# EAGLE design mon-one-exp-1wire (EAGLE 9.6.2)
Assembly variants: proto-click
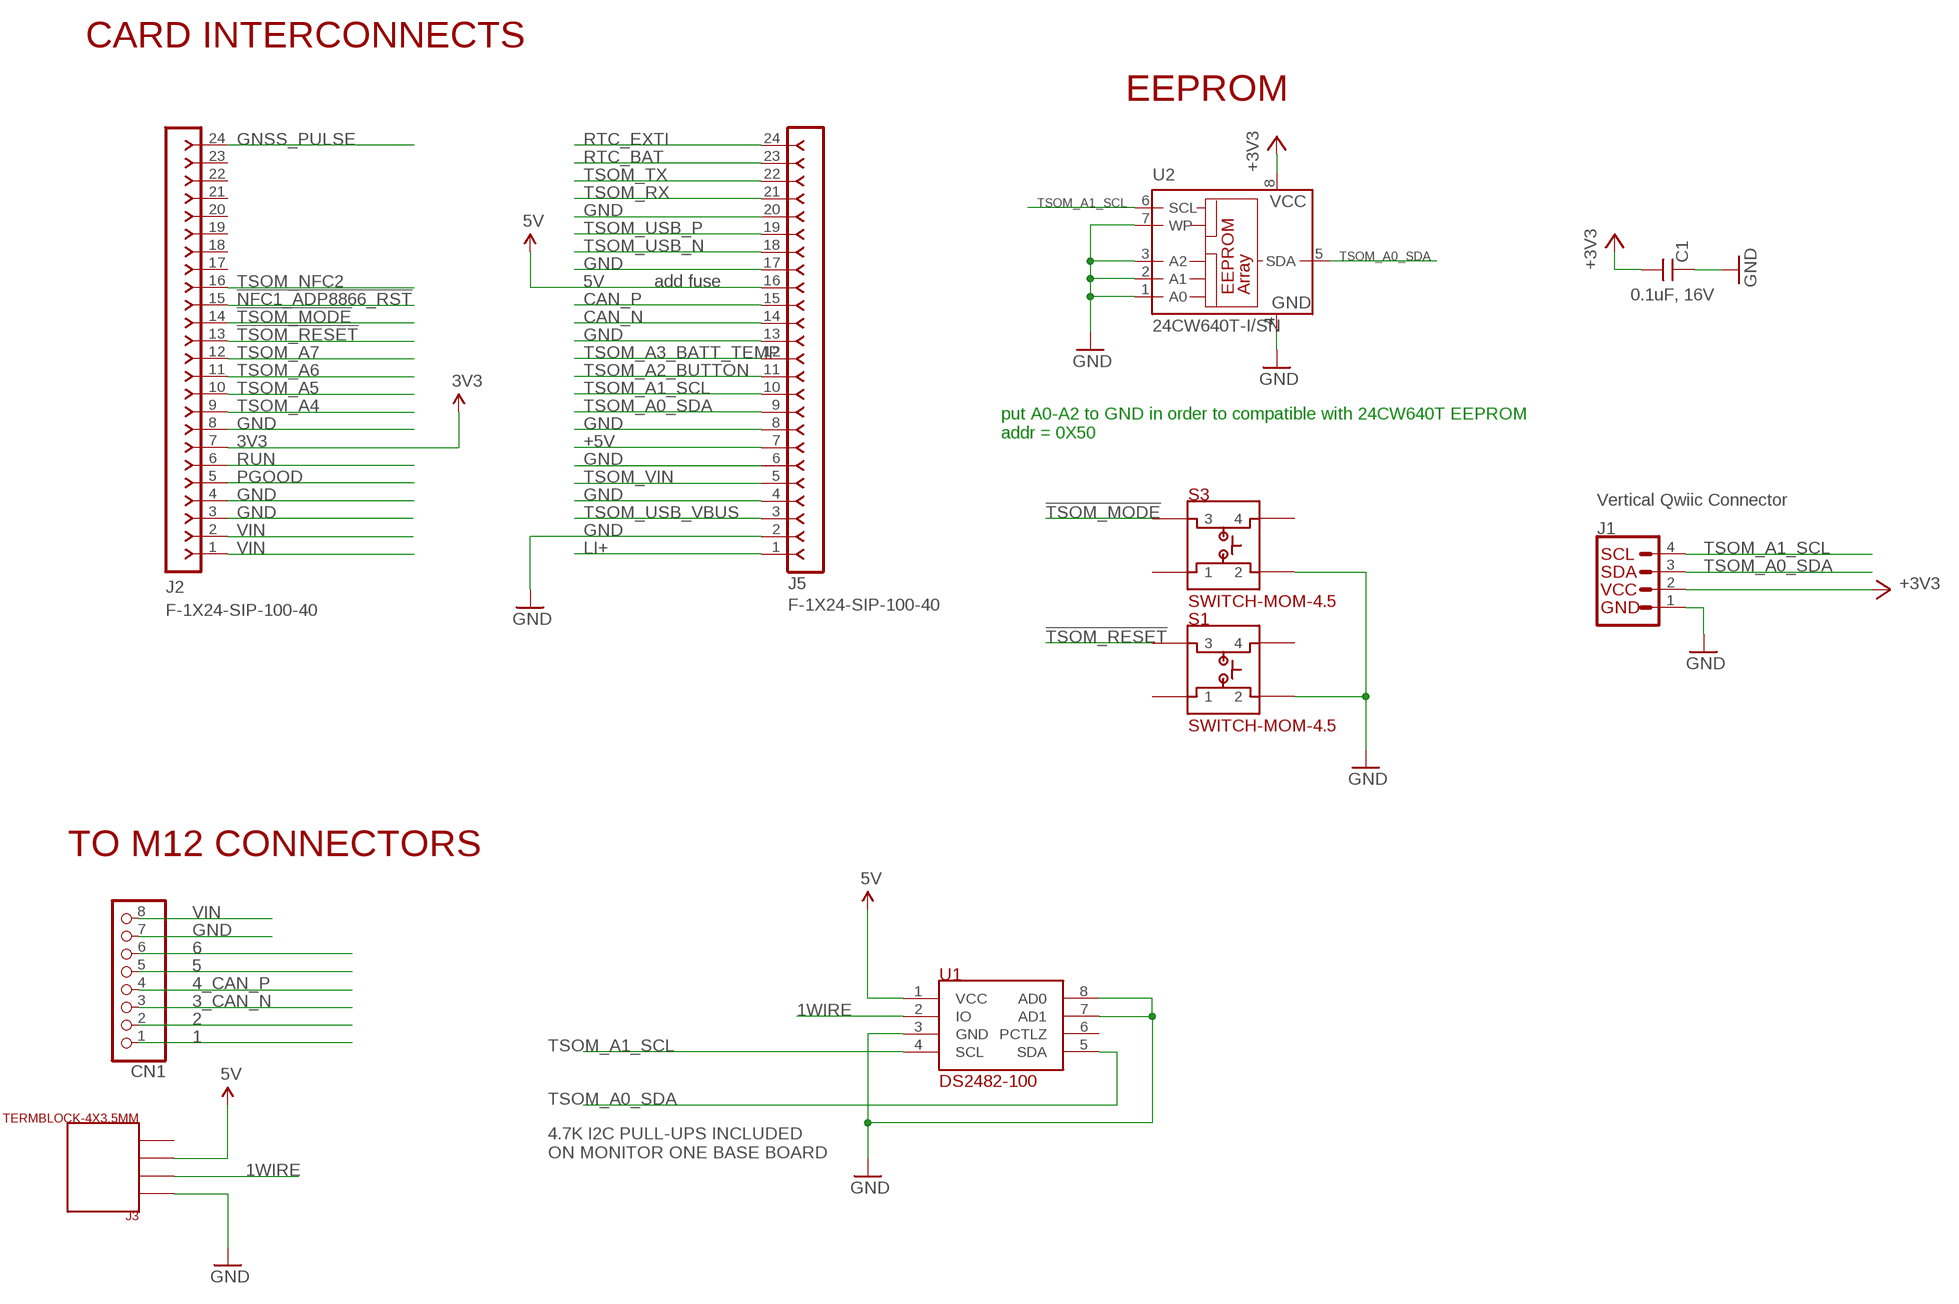
[diagram p0: schematic, sheet 1]

## Parts
C1  0.1uF, 16V  CAP_0.1UF_16V_0603  [C0603_P]  (not fitted in variant proto-click)
CN1  JST_8PIN  [JSTPH8]
J1  Vertical Qwiic Connector  QWIIC_CONNECTOR  [JST04_1MM_VERT]
J2  F-1X24-SIP-100-40  [SIP-100-24-40]
J3  TERMBLOCK-4X3.5MM  [TERMBLOCK-4X3.5MM]
J5  F-1X24-SIP-100-40  [SIP-100-24-40]
S1  SWITCH-MOM-4.5  [SWITCH-MOM-4.5]
S3  SWITCH-MOM-4.5  [SWITCH-MOM-4.5]
U1  DS2482-100  [8-SOIC-MAXIM]
U2  24CW640T-I/SN  24AA01SN  [SO-08]  (not fitted in variant proto-click)

## Nets
1: CN1.1
1WIRE: J3.2 U1.2(IO)
2: CN1.2
3_CAN_N: CN1.3
3V3: C1.1 J1.2 J2.7 U2.8(VCC) ; supply symbol labelled +3V3
4_CAN_P: CN1.4
5: CN1.5
5V: J3.3 J5.16 U1.1(VCC)
6: CN1.6
!NFC1_ADP8866_RST: J2.15
!TSOM_MODE: J2.14 S3.3
!TSOM_RESET: J2.13 S1.3
+5V: J5.7
CAN_N: J5.14
CAN_P: J5.15
GND: C1.2 CN1.7 J1.1 J2.3 J2.4 J2.8 J3.1 J5.2 J5.4 J5.6 J5.8 J5.13 J5.17 J5.20 S1.2 S3.2 U1.3(GND) U1.7(AD1) U1.8(AD0) U2.1(A0) U2.2(A1) U2.3(A2) U2.4(GND) U2.7(WP)
GNSS_PULSE: J2.24
LI+: J5.1
PGOOD: J2.5
RTC_BAT: J5.23
RTC_EXTI: J5.24
RUN: J2.6
TSOM_A0_SDA: J1.3 J5.9 U1.5(SDA) U2.5(SDA)
TSOM_A1_SCL: J1.4 J5.10 U1.4(SCL) U2.6(SCL)
TSOM_A2_BUTTON: J5.11
TSOM_A3_BATT_TEMP: J5.12
TSOM_A4: J2.9
TSOM_A5: J2.10
TSOM_A6: J2.11
TSOM_A7: J2.12
TSOM_NFC2: J2.16
TSOM_RX: J5.21
TSOM_TX: J5.22
TSOM_USB_N: J5.18
TSOM_USB_P: J5.19
TSOM_USB_VBUS: J5.3
TSOM_VIN: J5.5
VIN: CN1.8 J2.1 J2.2
Unconnected: J2.17 J2.18 J2.19 J2.20 J2.21 J2.22 J2.23 J3.4 S1.1 S1.4 S3.1 S3.4 U1.6(PCTLZ)

## Notes on the sheet
- CARD INTERCONNECTS
- EEPROM
- add fuse
- put A0-A2 to GND in order to compatible with 24CW640T EEPROM
  addr = 0X50
- TO M12 CONNECTORS
- 4.7K I2C PULL-UPS INCLUDED
  ON MONITOR ONE BASE BOARD

## Library data of the parts
C1 = particle-studios:CAP_: Particle Capacitors; DESP: CAP CER 0.1UF 16V X7R 0603; MFG: FENGHUA; MPN: 0603B104K160NT; PPN: PT-200082
CN1 = microbuilder:JST_8PIN: JST 8-Pin Right-Angle Connector
J1 = SparkFun-Connectors:QWIIC_CONNECTOR: SparkFun I2C Standard Qwiic Connector An SMD 1mm pitch JST connector makes it easy and quick (get it? Qwiic?) to connect I2C devices to each other. The Qwiic system <http://www.sparkfun.com/qwiic> enables fast and solderless connection between popular platforms and various sensors and actuators. We carry 200mm <https://www.sparkfun.com/products/14204>, 100mm <https://www.sparkfun.com/products/14205>, 50mm <https://www.sparkfun.com/products/14206>, and breadboard friendly <https://www.sparkfun.com/products/14207> Qwiic cables. We also offer 10 pcs strips <https://www.sparkfun.com/products/14323> the SMD connectors.; PROD_ID: CONN-14483
J2 J5 = con-headers-jp:F-1X24-: FEMALE HEADER
J3 = rickk2:TERMBLOCK-4X3.5MM: TERM BLK 4POS SIDE ENT 3.5MM PCB On Shore Technology Inc. OSTTE040161 $1.01 4 Position Wire to Board Terminal Block Horizontal with Board 0.138" (3.50mm) Through Hole https://www.digikey.com/product-detail/en/on-shore-technology-inc/OSTTE040161/ED2637-ND/614586
S1 S3 = rickk2:SWITCH-MOM-4.5: Manufacturer: E-Switch Manufacturer Part Number: TL3305AF160QG Description: SWITCH TACTILE SPST-NO 50MA 12V Detailed Description: Tactile Switch SPST-NO Top Actuated Surface Mount $0.20 https://www.digikey.com/product-detail/en/e-switch/TL3305AF160QG/EG5350CT-ND/5816195
U1 = rickk2:DS2482-100: IC BRIDGE I2C TO 1-WIRE 8-SOIC $1.54 1-Wire® Bridge, 1-Wire® to I²C I²C Interface 8-SOIC https://www.digikey.com/product-detail/en/maxim-integrated/DS2482S-100-/DS2482S-100--ND/1197435
U2 = microchip:24*: Serial EEPROM I2C; MF: MICROCHIP; MPN: 24AA01/SN; OC_FARNELL: 1331268; OC_NEWARK: 89C9792

## Net classes
1 USB: width 0.483 mm, clearance 0.152 mm
3 CAN: width 0.483 mm, clearance 0.152 mm

## Board
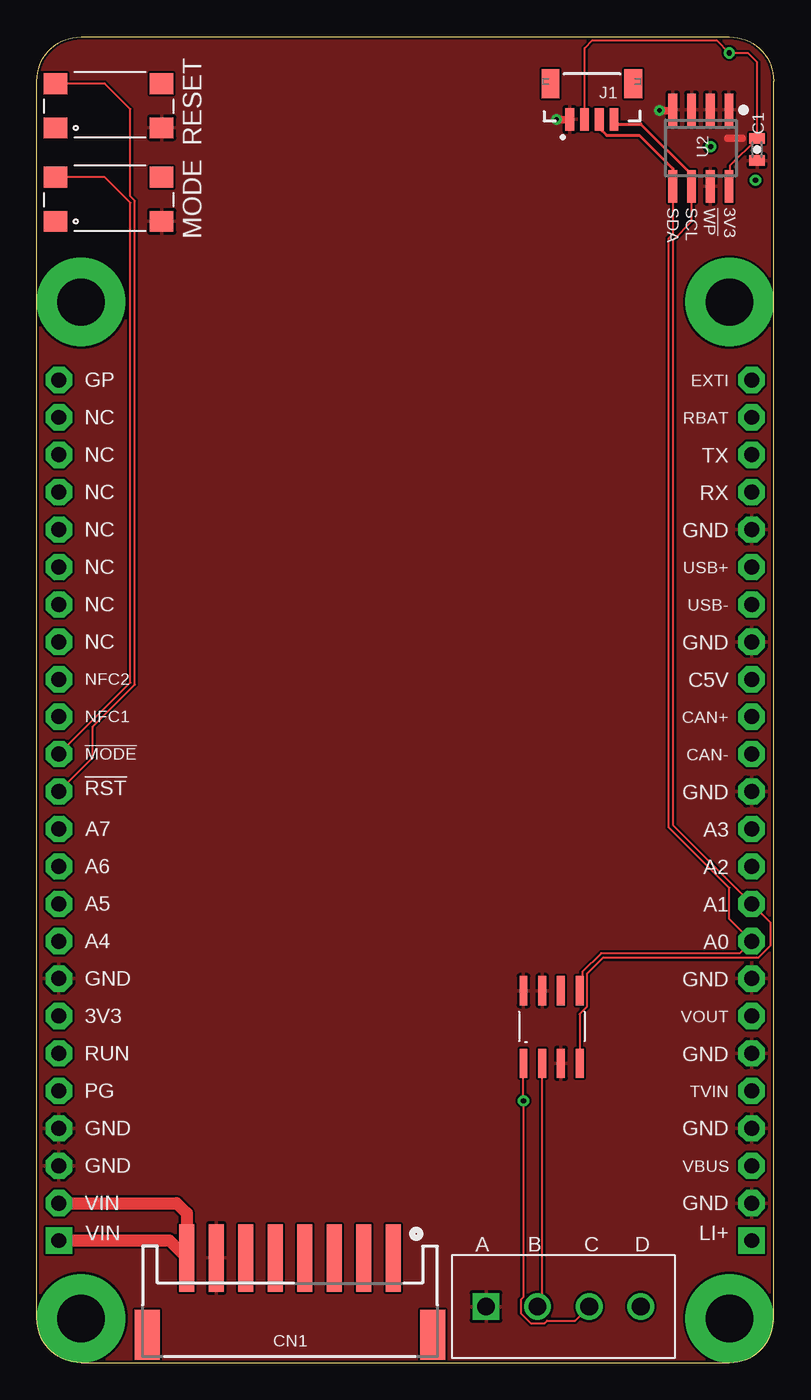
[diagram p1: board, top side]
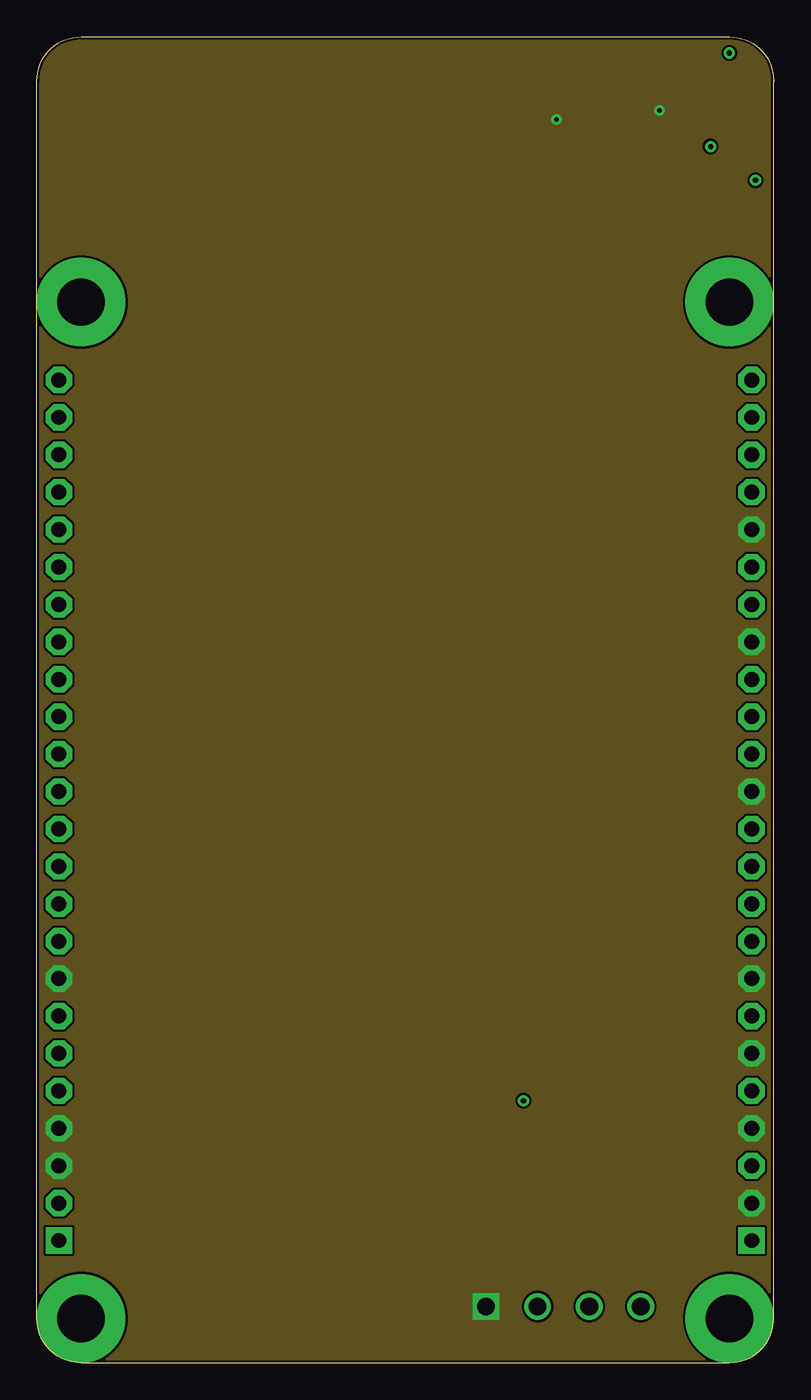
[diagram p2: board, inner layer Route2]
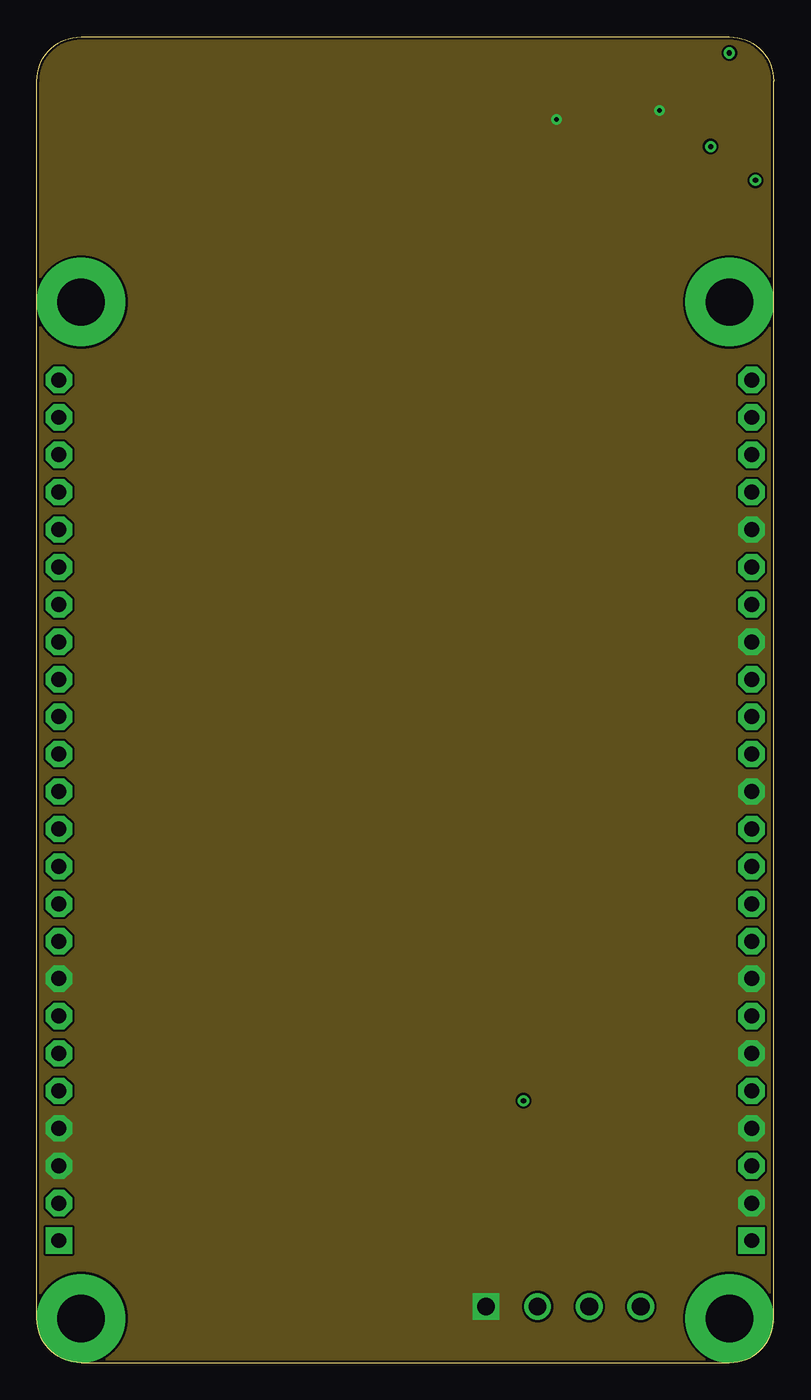
[diagram p3: board, inner layer Route15]
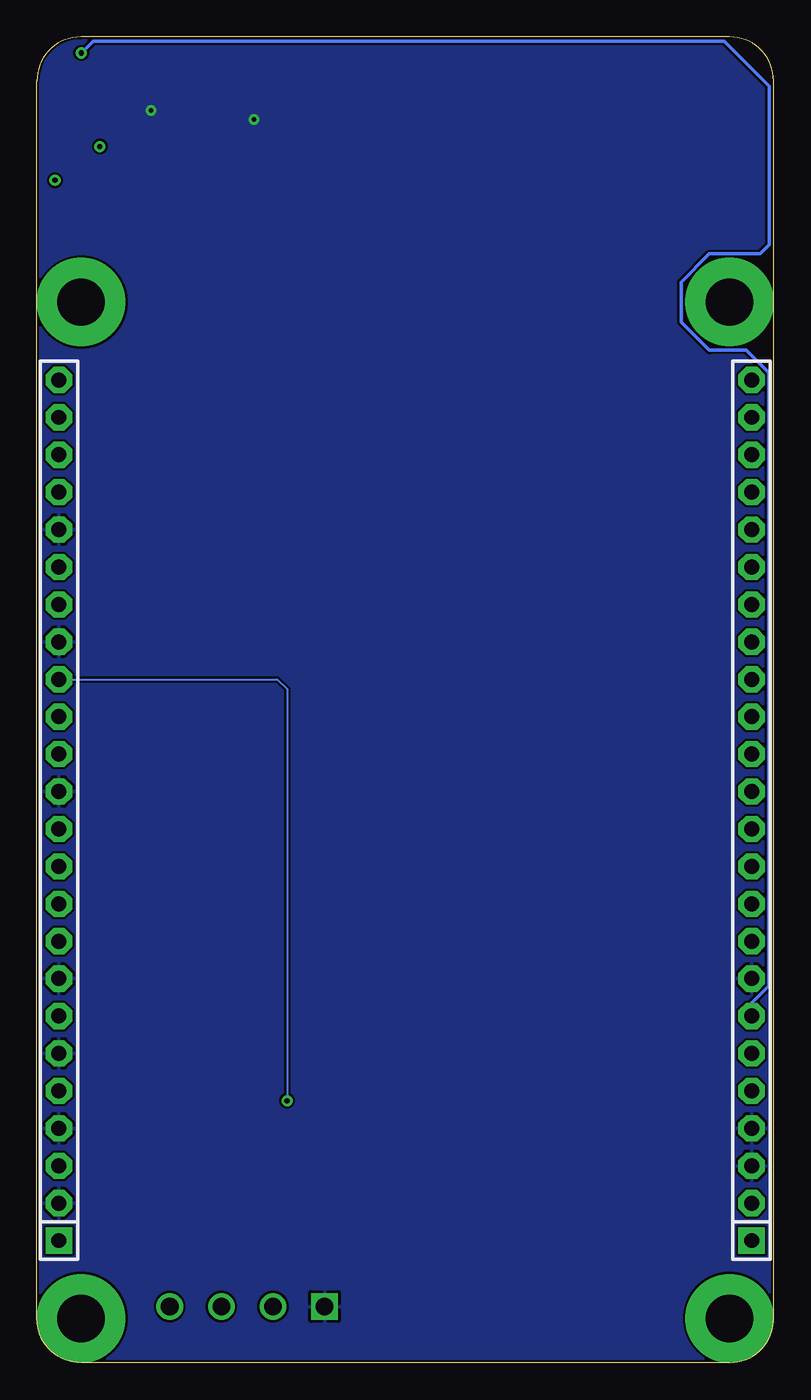
[diagram p4: board, bottom side, seen from below]

Size 50 x 90 mm. Coordinates in mm from the lower left corner, seen from the top.
Outline: 3,0 47,0 arc90 50,3 50,87 arc90 47,90 3,90 arc90 0,87 0,3 arc90 3,0
Copper layers (1*16): Top 0.035mm / dielectric 1.5mm / Bottom 0.035mm
Design rules "particle-2layer *": minimum track width 6mil, minimum drill 0.3mm, track to track 6mil, track to pad 6mil, pad to pad 6mil, via to via 6mil, smd to smd 6mil, copper to edge 6mil, drill to drill 6mil, minimum pad ring 12mil, minimum via ring 8mil, stop-mask expansion 0mil, vias tented up to drill 20mil, thermal gap 8mil

### Footprints (pad centres in the part's own frame; a part is rotated, then mirrored left to right if it is on the bottom)
C0603_P = smd 0.711 x 1.041: 1 -0.749,0; 2 0.749,0
JSTPH8 = smd 1 x 4.6: 1 -7,-3.7; 2 -5,-3.7; 3 -3,-3.7; 4 -1,-3.7; 5 1,-3.7; 6 3,-3.7; 7 5,-3.7; 8 7,-3.7 | smd 1.7 x 3.4: NC1 -9.7,1.5; NC2 9.7,1.5
JST04_1MM_VERT = smd 0.6 x 1.55: 1 -1.478,0.775; 2 -0.478,0.775; 3 0.522,0.775; 4 1.522,0.775 | smd 1.2 x 2: NC1 -2.778,3.2; NC2 2.822,3.2
SIP-100-24-40 = drill 1.016 pad 1.778 square: 1 -29.21,0 | drill 1.016 pad 1.778 octagon: 2 -26.67,0; 3 -24.13,0; 4 -21.59,0; 5 -19.05,0; 6 -16.51,0; 7 -13.97,0; 8 -11.43,0; 9 -8.89,0; 10 -6.35,0; 11 -3.81,0; 12 -1.27,0; 13 1.27,0; 14 3.81,0; 15 6.35,0; 16 8.89,0; 17 11.43,0; 18 13.97,0; 19 16.51,0; 20 19.05,0; 21 21.59,0; 22 24.13,0; 23 26.67,0; 24 29.21,0
TERMBLOCK-4X3.5MM = drill 1.2 square: 1 0,0 | drill 1.2: 2 3.5,0; 3 7,0; 4 10.5,0
SWITCH-MOM-4.5 = smd 1.6 x 1.4: 1 0,0; 2 7.2,0; 3 0,3; 4 7.2,3
8-SOIC-MAXIM = smd 0.53 x 1.98: 1 0,0; 2 1.27,0; 3 2.54,0; 4 3.81,0; 5 3.81,4.93; 6 2.54,4.93; 7 1.27,4.93; 8 0,4.93
SO-08 = smd 0.6 x 2.2: 1 -1.905,-2.6; 2 -0.635,-2.6; 3 0.635,-2.6; 4 1.905,-2.6; 5 1.905,2.6; 6 0.635,2.6; 7 -0.635,2.6; 8 -1.905,2.6

### Placement (x,y rotation side)
C1  48.87,82.35 270 top
CN1  17.18,3.4 180 top
J1  37.64,83.62 0 top
J2  1.5,37.5 90 bottom
J3  30.48,3.81 0 top
J5  48.5,37.5 90 bottom
S1  1.27,83.82 0 top
S3  1.27,77.47 0 top
U1  33.02,20.32 0 top
U2  45.06,82.45 180 top

### Tracks (layer width: path | path; a pad name or v marks a point on that pad's centre or on a via)
1WIRE
  Top 0.152: J3.2 34.29,4.12 U1.2
3V3  (via drill 0.35)
  Top 0.152: J1.2 37.16,89.23 37.69,89.76 46.13,89.76 v46.99,88.9 48.26,88.9 48.87,88.29 C1.1 47.02,81.25 47.02,79.91 U2.8
  Bottom 0.254: J2.7 1.5,24.42 0.33,25.59 0.33,66.98 0.29,67.02 0.33,67.06 0.33,67.19 1.86,68.72 4.36,68.72 6.28,70.64 6.28,73.36 4.36,75.28 0.92,75.28 0.29,75.91 0.29,86.65 3.35,89.71 46.18,89.71 v46.99,88.9
5V  (via drill 0.35)
  Top 0.152: J3.3 36.52,2.85 34.62,2.85 34.45,2.68 33.51,2.68 32.85,3.34 32.85,4.28 33.02,4.45 v33.02,17.78 U1.1
  Bottom 0.152: J5.16 33.69,46.39 33.02,45.72 v33.02,17.78
!TSOM_MODE
  Top 0.152: J2.14 6.35,46.16 6.35,78.74 4.62,80.47 S3.3
!TSOM_RESET
  Top 0.152: J2.13 3.81,41.08 3.81,43.18 6.66,46.02 6.66,78.87 6.35,79.17 6.35,85.09 4.62,86.82 S1.3
GND  (via drill 0.3)
  Top 0.508: J1.1 v35.26,84.38 | U2.4 43.09,84.99 v42.27,84.99 | 46.89,83.11 47.85,83.11
  pour Route2 (no thermals): 0,0 0,90.17 52.07,90.17 52.07,0
  pour Route15 (no thermals): 0,0 53.34,0 53.34,90.17 0,90.17
  pour Bottom: -1.27,-1.27 -1.27,90.17 52.07,90.17 52.07,-1.27
  pour Top: -1.27,-1.27 -1.27,91.44 53.34,91.44 53.34,-1.27
N$1  (via drill 0.35)
  other vias: 45.72,82.55
N$2  (via drill 0.35)
  other vias: 48.77,80.26
N$21  (via drill 3.2 pad 6)
  other vias: 3,3
N$23  (via drill 3.2 pad 6)
  other vias: 47,3
N$24  (via drill 3.2 pad 6)
  other vias: 3,72
N$27  (via drill 3.2 pad 6)
  other vias: 47,72
TSOM_A0_SDA
  Top 0.152: J5.9 46.99,30.12 46.99,32.23 42.88,36.34 42.88,76.33 43.18,76.63 43.18,79.82 | 48.5,28.18 J5.9 | 36.98,25.4 U1.5 37.02,25.44 37.02,26.53 38.29,27.8 47.69,27.8 J5.9
  Top 0.203: 43.18,79.82 U2.5 43.16,81.05 40.89,83.31 38.66,83.31 38.16,83.81 J1.3
TSOM_A1_SCL
  Top 0.152: U2.6 44.45,79.82 44.45,77.47 43.18,76.2 43.18,36.47 J5.10 49.76,29.89 49.76,28.29 48.96,27.49 38.41,27.49 37.32,26.4 37.32,24.16 36.83,23.67 U1.4
  Top 0.203: U2.6 44.42,80.64 40.99,84.07 39.48,84.07 J1.4
VIN
  Top 0.813: J2.1 8.99,8.29 CN1.8 10.18,10.14 9.49,10.83 J2.2

### Text on the board
tPlace: RESET | MODE | SDA | SCL | !WP | 3V3 | GP | EXTI | NC | RBAT | NC | TX | NC | RX | NC | GND | NC | USB+ | NC | USB- | NC | GND | NFC2 | C5V | NFC1 | CAN+ | !MODE | CAN- | !RST | GND | A7 | A3 | A6 | A2 | A5 | A1 | A4 | A0 | GND | GND | 3V3 | VOUT | RUN | GND | PG | TVIN | GND | GND | GND | VBUS | VIN | GND | VIN | LI+ | A | B | C | D